# Altium project Gesturelink.PrjPcb (part 4 of 4)

## Sheet Audio.SchDoc
size 420 x 297 mm; SheetNumber: 9; SheetTotal: 16
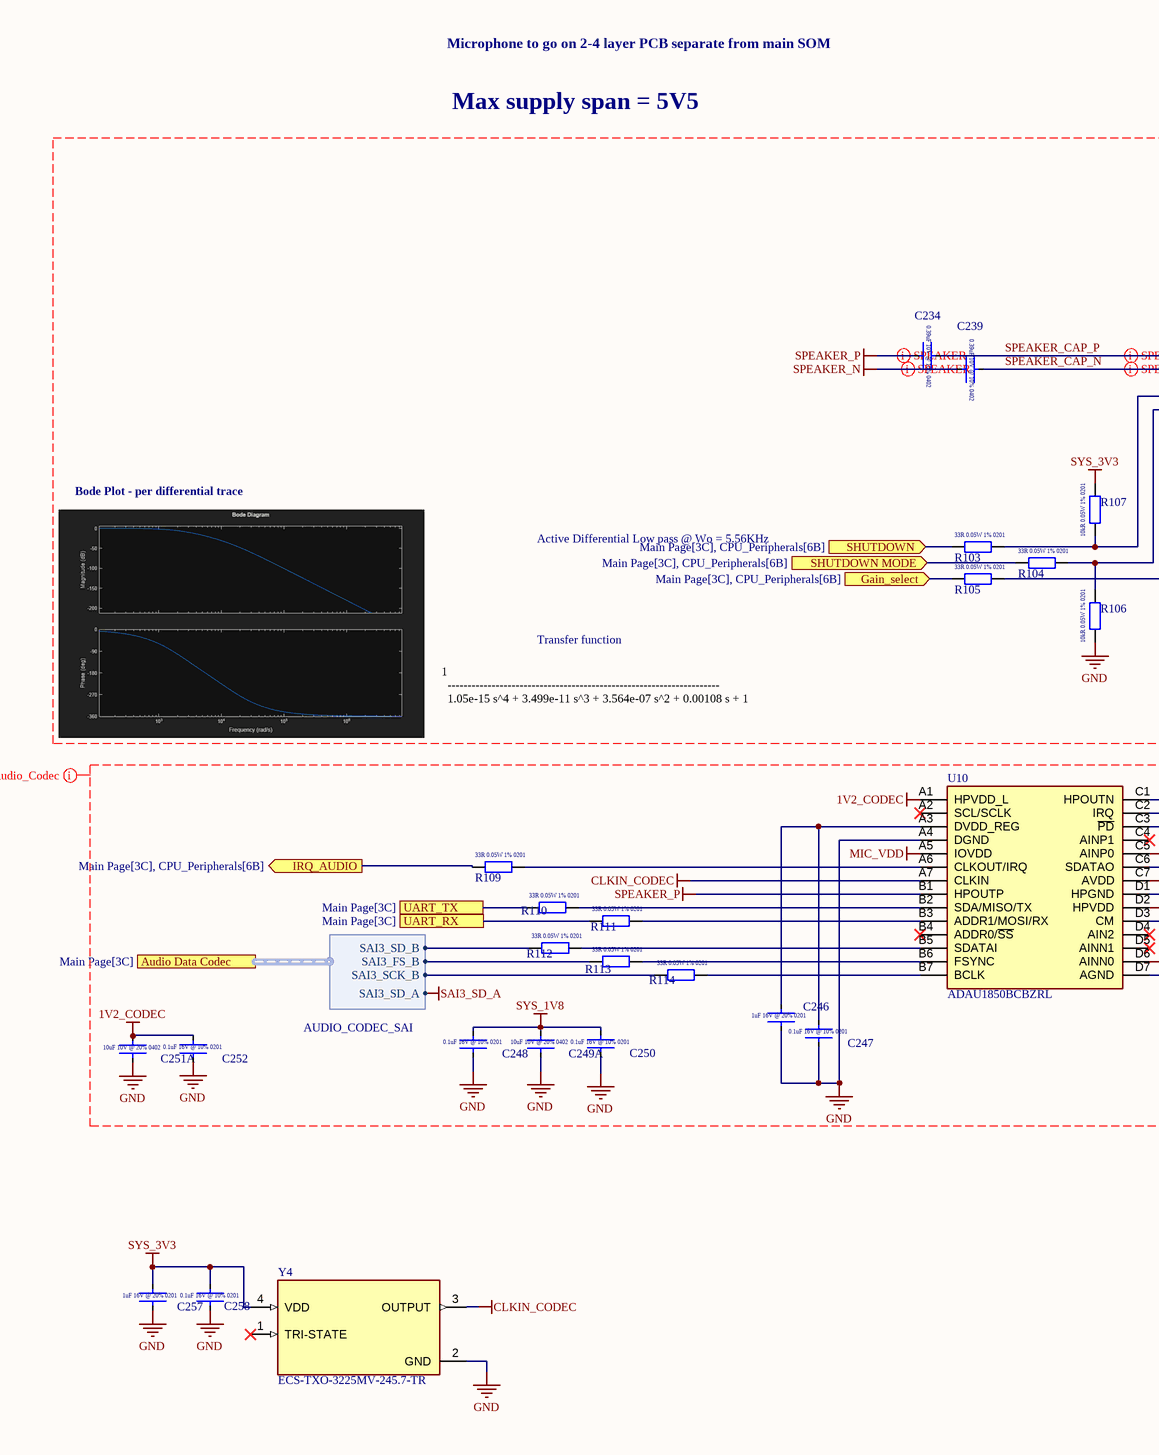
[diagram p19: Audio.SchDoc, left]
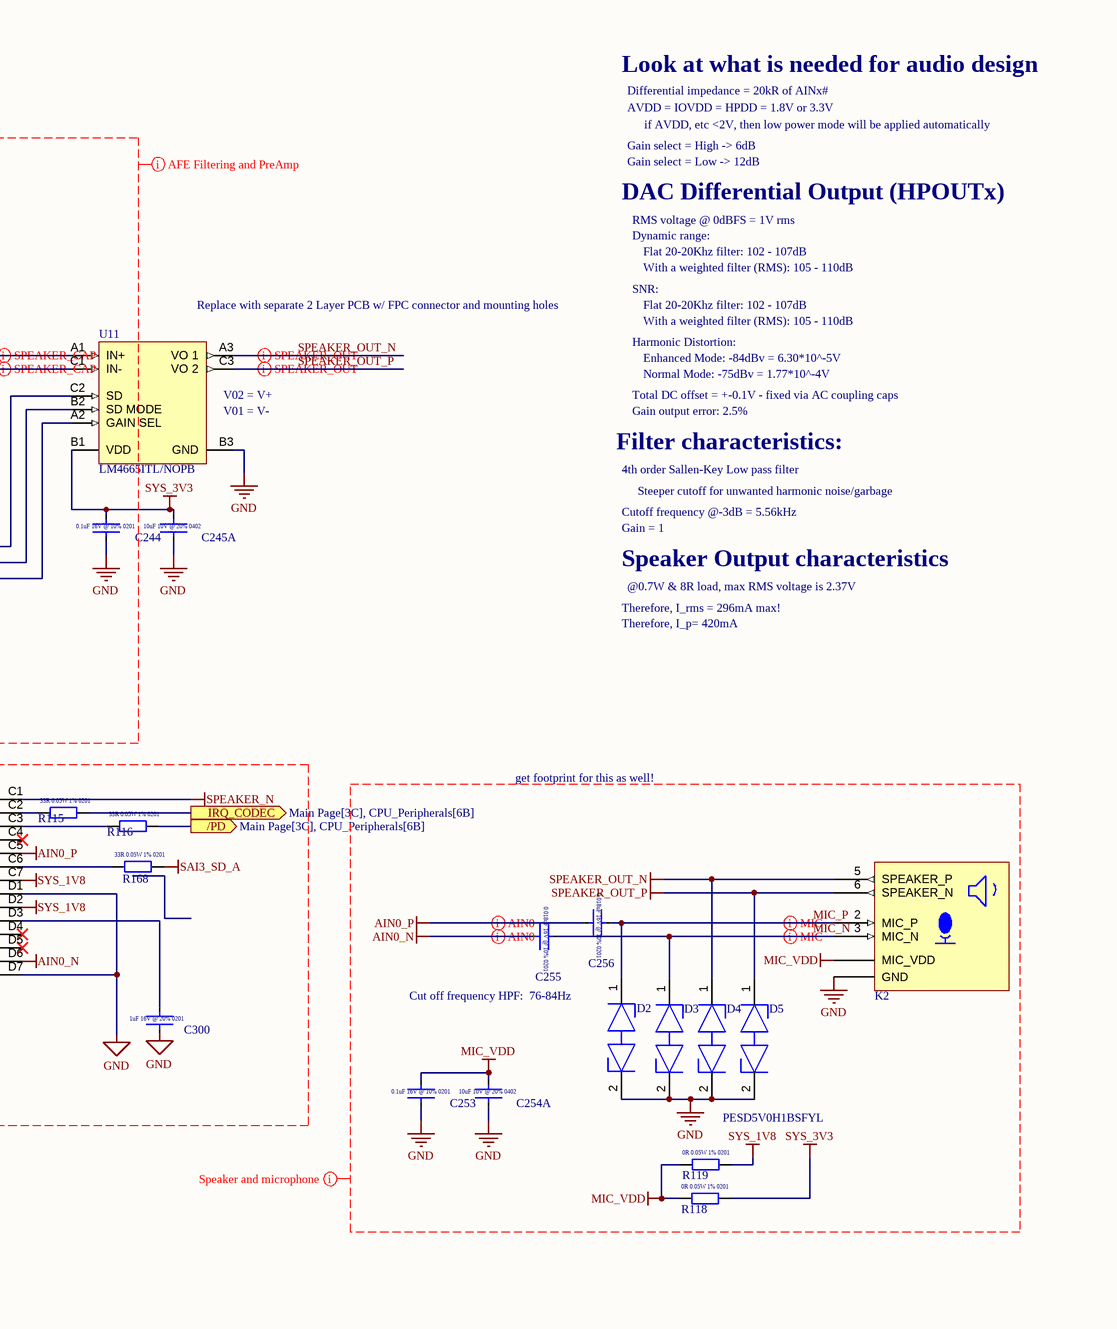
[diagram p20: Audio.SchDoc, right]

### Parts
C234  CC0402KRX5R6BB394  [CAPC1005X06L]  (value not drawn)
C239  CC0402KRX5R6BB394  [CAPC1005X06L]  (value not drawn)
C244  0.1uF  [CAPC0603X03L]  (value not drawn)
C245  GRT155R61A106ME13J  [CAPC1005X06L]  (value not drawn)  (part A of 2)
C246  GRM033R61C105ME15D  [CAPC0603X03L]  (value not drawn)
C247  0.1uF  [CAPC0603X03L]  (value not drawn)
C248  0.1uF  [CAPC0603X03L]  (value not drawn)
C249  GRT155R61A106ME13J  [CAPC1005X06L]  (value not drawn)  (part A of 2)
C250  0.1uF  [CAPC0603X03L]  (value not drawn)
C251  GRT155R61A106ME13J  [CAPC1005X06L]  (value not drawn)  (part A of 2)
C252  0.1uF  [CAPC0603X03L]  (value not drawn)
C253  0.1uF  [CAPC0603X03L]  (value not drawn)
C254  GRT155R61A106ME13J  [CAPC1005X06L]  (value not drawn)  (part A of 2)
C255  GRM033R61C183KE84D  [CAPC0603X03L]  (value not drawn)
C256  GRM033R61C183KE84D  [CAPC0603X03L]  (value not drawn)
C257  GRM033R61C105ME15D  [CAPC0603X03L]  (value not drawn)
C258  0.1uF  [CAPC0603X03L]  (value not drawn)
C300  GRM033R61C105ME15D  [CAPC0603X03L]  (value not drawn)
D2  PESD5V0H1BSFYL  [FP-SOD962-2-MFG]  (value not drawn)
D3  PESD5V0H1BSFYL  [FP-SOD962-2-MFG]  (value not drawn)
D4  PESD5V0H1BSFYL  [FP-SOD962-2-MFG]
D5  PESD5V0H1BSFYL  [FP-SOD962-2-MFG]  (value not drawn)
K2  DF40C-10DS-0.4V(51)  [DF40C-10DS-0.4V(51)]  (value not drawn)
R103  ERJ-1GNF33R0C  [RESC0603X03L]  (value not drawn)
R104  ERJ-1GNF33R0C  [RESC0603X03L]  (value not drawn)
R105  ERJ-1GNF33R0C  [RESC0603X03L]  (value not drawn)
R106  ERJ-1GNF1002C  [RESC0603X03L]  (value not drawn)
R107  ERJ-1GNF1002C  [RESC0603X03L]  (value not drawn)
R109  ERJ-1GNF33R0C  [RESC0603X03L]  (value not drawn)
R110  ERJ-1GNF33R0C  [RESC0603X03L]  (value not drawn)
R111  ERJ-1GNF33R0C  [RESC0603X03L]  (value not drawn)
R112  ERJ-1GNF33R0C  [RESC0603X03L]  (value not drawn)
R113  ERJ-1GNF33R0C  [RESC0603X03L]  (value not drawn)
R114  ERJ-1GNF33R0C  [RESC0603X03L]  (value not drawn)
R115  ERJ-1GNF33R0C  [RESC0603X03L]  (value not drawn)
R116  ERJ-1GNF33R0C  [RESC0603X03L]  (value not drawn)
R118  ERJ-1GN0R00C  [RESC0603X03L]  (value not drawn)
R119  ERJ-1GN0R00C  [RESC0603X03L]  (value not drawn)
R168  ERJ-1GNF33R0C  [RESC0603X03L]  (value not drawn)
U10  ADAU1850BCBZRL  [BGA28C40P7X4_296X176X57]
U11  LM4665ITL/NOPB  [YZR0009ADAD]
Y4  ECS-TXO-3225MV-245.7-TR  [OSC_ECS-TXO-3225MV-245.7-TR]

### Ports
/PD (out, see Main Page[3C], CPU_Peripherals[6B]), Audio Data Codec (harness AUDIO_CODEC_SAI, see Main Page[3C]), Gain_select (in, see Main Page[3C], CPU_Peripherals[6B]), IRQ_AUDIO (out, see Main Page[3C], CPU_Peripherals[6B]), IRQ_CODEC (out, see Main Page[3C], CPU_Peripherals[6B]), SHUTDOWN (in, see Main Page[3C], CPU_Peripherals[6B]), SHUTDOWN MODE (in, see Main Page[3C], CPU_Peripherals[6B]), UART_RX (see Main Page[3C]), UART_TX (see Main Page[3C])

### Harnesses
AUDIO_CODEC_SAI: SAI3_FS_B, SAI3_SCK_B, SAI3_SD_B, SAI3_SD_A

### Nets
1V2_CODEC: C251.2 C252.2 U10.A1(HPVDD_L)
AIN0_N: C255.1 U10.D6(AINN0)
AIN0_P: C256.1 U10.C5(AINP0)
CLKIN_CODEC: U10.A7(CLKIN) Y4.3(OUTPUT)
GND: C244.1 C245.1 C246.1 C247.1 C248.1 C249.1 C250.1 C251.1 C252.1 C253.1 C254.1 C257.1 C258.1 C300.1 D2.2(K2) D3.2(K2) D4.2(K2) D5.2(K2) K2.1,4,7,8,9,10,11,14(GND) R106.1 U10.A4(DGND) U10.D1(HPGND) U10.D7(AGND) U11.B3(GND) Y4.2(GND)
MIC_VDD: C253.2 C254.2 K2.12,13(MIC_VDD) R118.1 R119.1 U10.A5(IOVDD)
SAI3_FS_B: R113.1 ; port Audio Data Codec.SAI3_FS_B
SAI3_SCK_B: R114.1 ; port Audio Data Codec.SAI3_SCK_B
SAI3_SD_A: R168.2 ; port Audio Data Codec.SAI3_SD_A
SAI3_SD_B: R112.1 ; port Audio Data Codec.SAI3_SD_B
SPEAKER_N: C239.1 U10.C1(HPOUTN)
SPEAKER_OUT_N: D4.1(K1) K2.5(SPEAKER_P) U11.A3(VO_1)
SPEAKER_OUT_P: D5.1(K1) K2.6(SPEAKER_N) U11.C3(VO_2)
SPEAKER_P: C234.1 U10.B1(HPOUTP)
SYS_1V8: C248.2 C249.2 C250.2 R119.2 U10.C7(AVDD) U10.D2(HPVDD)
SYS_3V3: C244.2 C245.2 C257.2 C258.2 R107.2 R118.2 U11.B1(VDD) Y4.4(VDD)
/PD_CODEC: R116.2 ; port /PD
BKUP_IRQ_CODEC: R109.1 ; port IRQ_AUDIO
MAIN_IRQ_CODEC: R115.2 ; port IRQ_CODEC
MIC_N: C255.2 D3.1(K1) K2.3(MIC_N)
MIC_P: C256.2 D2.1(K1) K2.2(MIC_P)
PA_GAIN: R105.1 ; port Gain_select
PA_SHDN: R103.1 ; port SHUTDOWN
PA_SHDN_MODE: R104.1 ; port SHUTDOWN MODE
SPEAKER_CAP_N: C239.2 U11.C1(IN-)
SPEAKER_CAP_P: C234.2 U11.A1(IN+)
UART5_RX: R111.1 ; port UART_RX
UART5_TX: R110.1 ; port UART_TX
NetC246_2: C246.2 C247.2 U10.A3(DVDD_REG)
NetC300_2: C300.2 U10.D3(CM)
NetR103_2: R103.2 R107.1 U11.C2(SD)
NetR104_2: R104.2 R106.2 U11.B2(SD_MODE)
NetR105_2: R105.2 U11.A2(GAIN_SEL)
NetR109_2: R109.2 U10.A6(CLKOUT/IRQ)
NetR110_2: R110.2 U10.B2(SDA/MISO/TX)
NetR111_2: R111.2 U10.B3(ADDR1/MOSI/RX)
NetR112_2: R112.2 U10.B5(SDATAI)
NetR113_2: R113.2 U10.B6(FSYNC)
NetR114_2: R114.2 U10.B7(BCLK)
NetR115_1: R115.1 U10.C2(IRQ)
NetR116_1: R116.1 U10.C3(~{PD})
NetR168_1: R168.1 U10.C6(SDATAO)

Not connected (* = marked no-connect by the designer): U10 A2(SCL/SCLK)* B4(ADDR0/~{SS})* C4(AINP1)* D4(AIN2)* D5(AINN1)*; Y4 1(TRI-STATE)*

### Layout directives
mark named Audio FPC: (no net found under the mark)
differential pair: MIC_N, MIC_P, SPEAKER_CAP_N, SPEAKER_CAP_P, SPEAKER_N, SPEAKER_OUT_N, SPEAKER_OUT_P, SPEAKER_P
differential pair; net class *: AIN0_N, AIN0_P
net class Audio Codec: 1V2_CODEC, AIN0_N, AIN0_P, CLKIN_CODEC, GND, MIC_VDD, SAI3_SD_A, SPEAKER_N, SPEAKER_P, SYS_1V8
net class Speaker and microphone: AIN0_N, AIN0_P, GND, MIC_N, MIC_P, MIC_VDD, SPEAKER_OUT_N, SPEAKER_OUT_P, SYS_1V8, SYS_3V3
net class AFE Filtering and PreAmp: GND, SPEAKER_CAP_N, SPEAKER_CAP_P, SPEAKER_N, SPEAKER_P, SYS_3V3

### Notes on the sheet
- Microphone to go on 2-4 layer PCB separate from main SOM
- Look at what is needed for audio design
- Max supply span = 5V5
- Gain select = High -> 6dB
- Differential impedance = 20kR of AINx#
- AVDD = IOVDD = HPDD = 1.8V or 3.3V
- if AVDD, etc <2V, then low power mode will be applied automatically
- DAC Differential Output (HPOUTx)
- Gain select = Low -> 12dB
- RMS voltage @ 0dBFS = 1V rms
- Dynamic range:
- Flat 20-20Khz filter: 102 - 107dB
- With a weighted filter (RMS): 105 - 110dB
- (near U11) Replace with separate 2 Layer PCB w/ FPC connector and mounting holes
- SNR:
- Harmonic Distortion:
- (near U11) V02 = V+
- (near U11) V01 = V-
- Total DC offset = +-0.1V - fixed via AC coupling caps
- Gain output error: 2.5%
- Enhanced Mode: -84dBv = 6.30*10^-5V
- Normal Mode: -75dBv = 1.77*10^-4V
- Filter characteristics:
- 4th order Sallen-Key Low pass filter
- Bode Plot - per differential trace
- Active Differential Low pass @ Wo = 5.56KHz
- Cutoff frequency @-3dB = 5.56kHz
- Gain = 1
- Steeper cutoff for unwanted harmonic noise/garbage
- Speaker Output characteristics
- Therefore, I_rms = 296mA max!
- @0.7W & 8R load, max RMS voltage is 2.37V
- Transfer function
- Therefore, I_p= 420mA
- 1
  --------------------------------------------------------------------
  1.05e-15 s^4 + 3.499e-11 s^3 + 3.564e-07 s^2 + 0.00108 s + 1
- get footprint for this as well!
- (near D2) Cut off frequency HPF:  76-84Hz
- THIS DOCUMENT AND THE DATA DISCLOSED HEREIN OR
- HEREWITH IS THE PROPERTY OF ALTIUM LIMITED AND MAY
- DWG NO:
- REVISION
- REV:
- DESCRIPTION
- DATE
- APPROVED
- BE FREELY DISTRIBUTED IN WHOLE. NO RIGHTS ARE
- RESERVED OR EXPRESS OR IMPLIED WARANTEE GIVEN.
- ENG:
- APPROVALS
- PROJECT
- DSN:
- CHK:
- REFERENCE DOCUMENTS
- PROJECT REVISION:
- TITLE
- DOCUMENT REVISION:
- DESIGN ITEM:
- BOM:
- FAB DWG:
- PCB DWG:
- ASSY DWG:
- SCALE:
- A3
- SIZE
- CAGE CODE
- FILE NAME
- DWG NO.
- SHEET
- OF
- REV
- (in symbol CC0402KRX5R6BB394) 0.39uF 10V @ 10% 0402
- (in symbol ERJ-1GN0R00C) 0R 0.05W 1% 0201
- (in symbol ERJ-1GNF33R0C) 33R 0.05W 1% 0201
- (in symbol ERJ-1GNF1002C) 10kR 0.05W 1% 0201
- (in symbol GRM033R61C105ME15D) 1uF 16V @ 20% 0201
- (in symbol GRM033R61C183KE84D) 0.018uF 16V @ 10% 0201
- (in symbol GRM033R61E104KE14J) 0.1uF 16V @ 10% 0201
- (in symbol GRT155R61A106ME13J, part A) 10uF 10V @ 20% 0402

### Library data of the parts
C234 C239 = CC0402KRX5R6BB394: 0.39 µF ±10% 10V Ceramic Capacitor X5R 0402 (1005 Metric); ComponentLink1Description: New link; ComponentLink1URL: https://www.digikey.com.au/en/products/detail/yageo/CC0402KRX5R6BB394/20376267
C244 C247 C248 C250 C252 C253 C258 = GRM033R61E104KE14J: 0.1 µF ±10% 25V Ceramic Capacitor X5R 0201 (0603 Metric)0.1 µF ±10% 25V Ceramic Capacitor X5R 0201 (0603 Metric); ComponentLink1Description: New link; ComponentLink1URL: https://www.digikey.com.au/en/products/detail/murata-electronics/GRM033R61E104KE14J/4904732?s=N4IgTCBcDaIOICUCyAGAzGhA2AjAURxQBYBpAogKRAF0BfIA
C245 C249 C251 C254 = GRT155R61A106ME13J: 10 µF ±20% 10V Ceramic Capacitor X5R 0402 (1005 Metric); ComponentLink1Description: New link; ComponentLink1URL: https://www.digikey.com.au/en/products/detail/murata-electronics/GRT155R61A106ME13J/19115510
C246 C257 C300 = GRM033R61C105ME15D: 1 µF ±20% 16V Ceramic Capacitor X5R 0201 (0603 Metric); ComponentLink1Description: New link; ComponentLink1URL: https://www.digikey.com.au/en/products/detail/murata-electronics/GRM033R61C105ME15D/10326307
C255 C256 = GRM033R61C183KE84D: 0.018 µF ±10% 16V Ceramic Capacitor X5R 0201 (0603 Metric); ComponentLink1Description: New link; ComponentLink1URL: https://www.digikey.com.au/en/products/detail/murata-electronics/GRM033R61C183KE84D/5027499
D2-D5 = CMP-14436-000004-1: TVS DIODE 5V 5V DSN0603-2; Manufacturer: Nexperia; Breakdown Voltage: 6V; Direction: Bidirectional; Value: 0.15pF; Clamping Voltage: 6.3V; Number Of Channels: 1; Peak Pulse Current: 7A; Max Junction Temp: +150°C; Lead Free: Yes; Reverse Standoff Voltage: 5V; Footprint Url: https://assets.nexperia.com/documents/outline-drawing/SOD962-2.pdf; ComponentLink2Description: Datasheet; Height: 0.32mm; Ambient Temperature Range Low: -40°C; Manufacturer Part Number: PESD5V0H1BSFYL; Octopart: https://octopart.com/pesd5v0h1bsfyl-nexperia-78741149; Ambient Temperature Range High: +125°C; RoHS: TRUE; Temperature: to +150°C; Capacitance: 0.15pF; ComponentLink2URL: https://assets.nexperia.com/documents/data-sheet/PESD5V0H1BSF.pdf; Temperature Range High: +150°C; Device Class L2: TVS Diodes; Digikey Description: TVS DIODE 5V 5V DSN0603-2; Category: Diode; Device Class L3: unset; Device Class L1: Circuit Protection; Package: SOD962-2; Automotive: No
K2 = DF40C-10DS-0.4V(51): 10 Position Connector Plug, Outer Shroud Contacts Surface Mount Gold; ComponentLink1Description: New link; ComponentLink1URL: https://www.digikey.com.au/en/products/detail/hirose-electric-co-ltd/DF40C-10DP-0-4V-51/1969496; Supplier 1: Digikey; Supplier Part Number 1: H11616CT-ND
R103-R105 R109-R116 R168 = ERJ-1GNF33R0C: as R73-R80 on sheet WIFI and BLE; ComponentLink1Description: New link; ComponentLink1URL: https://www.digikey.com.au/en/products/detail/panasonic-electronic-components/ERJ-1GNF33R0C/2035941
R106 R107 = ERJ-1GNF1002C: as R66-R68 on sheet WIFI and BLE; ComponentLink1Description: New link; ComponentLink1URL: https://www.digikey.com.au/en/products/detail/panasonic-electronic-components/ERJ-1GNF1002C/2036226
R118 R119 = ERJ-1GN0R00C: 0 Ohms Jumper Chip Resistor 0201 (0603 Metric) Thick Film; ComponentLink1Description: New link; ComponentLink1URL: https://www.digikey.com.au/en/products/detail/panasonic-electronic-components/ERJ-1GN0R00C/3982613
U10 = ADAU1850BCBZRL: Integrated Circuit; Manufacturer_Name: Analog Devices; Datasheet Link: https://www.analog.com/ADAU1850/datasheet?ADICID=SYND_WW_P682800_PF-spglobal; Height: 0.57mm; Manufacturer_Part_Number: ADAU1850BCBZRL
U11 = CMP-0057-00216-3: Filterless High Efficiency 1W Switching Audio Amplifier, 9-pin Micro SMD, Pb-Free; Manufacturer: Texas Instruments; CompType: Audio IC; PowerWise: N; High-Reliability: Y; PackageTopMarking: XVG*I A2; RoHS: Y; PackageReference: YZR0009ADAD; PartNumber: LM4665ITL/NOPB; PinCount: 9; Code_JEDEC: MO-211-DD; ComponentLink1URL: http://www.ti.com/general/docs/lit/getliterature.tsp?genericPartNumber=LM4665&fileType=pdf; PackageDescription: Thin Micro SMD, 9 Bump (Large), 0.5mm Pitch; ComponentLink1Description: Datasheet URL; ComponentLink2Description: New link; ComponentLink2URL: https://www.digikey.com.au/en/products/detail/texas-instruments/LM4665ITL-NOPB/947582?srsltid=AfmBOooQQxw4q3qhtfItGu5hSrTxqZeWwiOQWCJ-ImR-j4MOWvtk_TuD
Y4 = ECS-TXO-3225MV-245.7-TR: TCXO Oscillators 24.576 MHZ Multi-Volt +1.7 3.6V HCMOS TCXO +/-2.5 ppm -30 +85 C 3.2x 2.5mm RoHS; MF: ECS; SnapEDA_Link: https://www.snapeda.com/parts/ECS-TXO-3225MV-245.7-TR/ECS/view-part/?ref=snap; Package: ECS-TXO-3225MV-0-4 ECS; Value: *; MP: ECS-TXO-3225MV-245.7-TR; Check_prices: https://www.snapeda.com/parts/ECS-TXO-3225MV-245.7-TR/ECS/view-part/?ref=eda; ComponentLink1Description: New link; ComponentLink1URL: https://www.digikey.com.au/en/products/detail/ecs-inc/ECS-TXO-3225MV-245-7-TR/16578392?s=N4IgjCBcpgHAzFUBjKAzAhgGwM4FMAaEAeygG0QAWMABgDYAmOkAXSIAcAXKEAZU4BOASwB2AcxABfIgwDszaCFSRMuQiXIg6YeDRqsO3SH0GiJ08AE5YlpEvTZ8RUpAr6WFhmACs%2BxctUnDVcQBkoAOm95AAIAWQAJAC8DEC4eAFURIU4AeTRYvAwcAFcBPClJSSA

## Sheet External Power Connectors.SchDoc
size A4; SheetNumber: 16; SheetTotal: 16
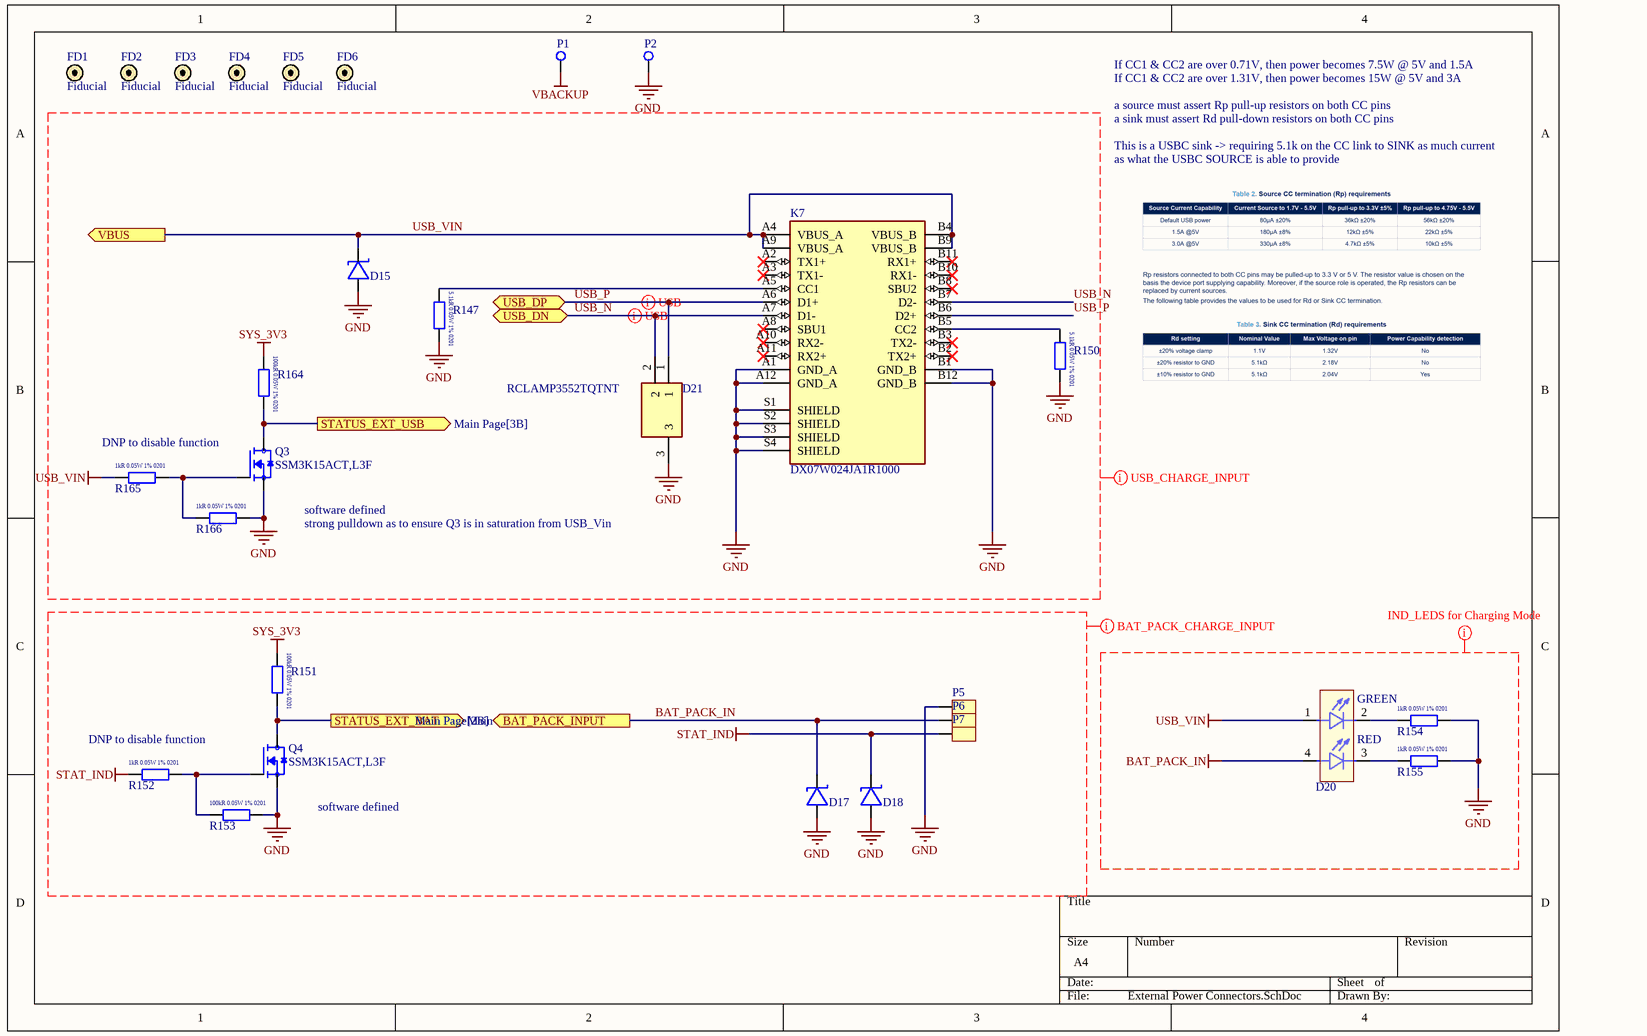
[diagram p21: External Power Connectors.SchDoc]

### Parts
D15  RCLAMP04041PW.C  [RCLAMP04041PW.C]  (value not drawn)
D17  RCLAMP04041PW.C  [RCLAMP04041PW.C]  (value not drawn)
D18  RCLAMP04041PW.C  [RCLAMP04041PW.C]  (value not drawn)
D20  APGB0607G22R23C  [LED_APGB0607G22R23C]  (value not drawn)
D21  RCLAMP3552TQTNT  [RCLAMP3552TQTNT]
FD1  Fiducial  [Fiducial]
FD2  Fiducial  [Fiducial]
FD3  Fiducial  [Fiducial]
FD4  Fiducial  [Fiducial]
FD5  Fiducial  [Fiducial]
FD6  Fiducial  [Fiducial]
K7  DX07W024JA1R1000  [JAE_DX07W024JA1R1000]
P1  Pogo pin Pad  [S70-220101045R]  (value not drawn)
P2  Pogo pin Pad  [S70-220101045R]  (value not drawn)
P5  Pad for Bat  [Pad for Bat]  (value not drawn)
P6  Pad for Bat  [Pad for Bat]  (value not drawn)
P7  Pad for Bat  [Pad for Bat]  (value not drawn)
Q3  SSM3K15ACT,L3F  [SSM3K15ACT]
Q4  SSM3K15ACT,L3F  [SSM3K15ACT]
R147  ERJ-1GNF5101C  [RESC0603X03L]  (value not drawn)
R150  ERJ-1GNF5101C  [RESC0603X03L]  (value not drawn)
R151  ERJ-1GNF1003C  [RESC0603X03L]  (value not drawn)
R152  ERJ-1GNF1001C  [RESC0603X03L]  (value not drawn)
R153  ERJ-1GNF1003C  [RESC0603X03L]  (value not drawn)
R154  ERJ-1GNF1001C  [RESC0603X03L]  (value not drawn)
R155  ERJ-1GNF1001C  [RESC0603X03L]  (value not drawn)
R164  ERJ-1GNF1003C  [RESC0603X03L]  (value not drawn)
R165  ERJ-1GNF1001C  [RESC0603X03L]  (value not drawn)
R166  ERJ-1GNF1001C  [RESC0603X03L]  (value not drawn)

### Ports
BAT_PACK_INPUT (out, see Main Page[2B]), STATUS_EXT_BAT (out, see Main Page[3B]), STATUS_EXT_USB (out, see Main Page[3B]), USB_DN (bidir, see Main Page[3B]), USB_DP (bidir, see Main Page[3B]), VBUS (out, see Main Page[2B])

### Nets
BAT_PACK_IN: D17.2 D20.4(A_RED) P6.1 ; port BAT_PACK_INPUT
GND: D15.1 D17.1 D18.1 D21.3 K7.A1(GND_A) K7.A12(GND_A) K7.B1(GND_B) K7.B12(GND_B) K7.S1(SHIELD) K7.S2(SHIELD) K7.S3(SHIELD) K7.S4(SHIELD) P2.1 P5.1 Q3.3(S) Q4.3(S) R147.2 R150.2 R153.2 R154.2 R155.2 R166.2
STAT_IND: D18.2 P7.1 R152.1
SYS_3V3: R151.1 R164.1
USB_VIN: D15.2 D20.1(A_GREEN) K7.A4(VBUS_A) K7.A9(VBUS_A) K7.B4(VBUS_B) K7.B9(VBUS_B) R165.1 ; port VBUS
VBACKUP: P1.1
STATUS_EXT_BAT_MPU: Q4.2(D) R151.2 ; port STATUS_EXT_BAT
STATUS_EXT_USB_MPU: Q3.2(D) R164.2 ; port STATUS_EXT_USB
USB_N: D21.2 K7.A7(D1-) K7.B7(D2-) ; port USB_DN
USB_P: D21.1 K7.A6(D1+) K7.B6(D2+) ; port USB_DP
NetD20_2: D20.2(C_GREEN) R154.1
NetD20_3: D20.3(C_RED) R155.1
NetK7_A5: K7.A5(CC1) R147.1
NetK7_B5: K7.B5(CC2) R150.1
NetQ3_1: Q3.1(G) R165.2 R166.1
NetQ4_1: Q4.1(G) R152.2 R153.1

Not connected (* = marked no-connect by the designer): K7 A2(TX1+)* A3(TX1-)* A8(SBU1)* A10(RX2-)* A11(RX2+)* B2(TX2+)* B3(TX2-)* B8(SBU2)* B10(RX1-)* B11(RX1+)*

### Layout directives
differential pair: USB_N, USB_P
net class USB_CHARGE_INPUT: GND, SYS_3V3, USB_N, USB_P, USB_VIN
net class BAT_PACK_CHARGE_INPUT: BAT_PACK_IN, GND, STAT_IND, SYS_3V3
net class IND_LEDS for Charging Mode: BAT_PACK_IN, GND, USB_VIN

### Notes on the sheet
- If CC1 & CC2 are over 0.71V, then power becomes 7.5W @ 5V and 1.5A
- If CC1 & CC2 are over 1.31V, then power becomes 15W @ 5V and 3A
- a source must assert Rp pull-up resistors on both CC pins
- a sink must assert Rd pull-down resistors on both CC pins
- This is a USBC sink -> requiring 5.1k on the CC link to SINK as much current
- as what the USBC SOURCE is able to provide
- (near Q3) DNP to disable function
- software defined
- strong pulldown as to ensure Q3 is in saturation from USB_Vin
- DNP to disable function
- (in symbol APGB0607G22R23C) GREEN; RED
- (in symbol ERJ-1GNF1001C) 1kR 0.05W 1% 0201
- (in symbol ERJ-1GNF1003C) 100kR 0.05W 1% 0201
- (in symbol ERJ-1GNF5101C) 5.1kR 0.05W 1% 0201

### Library data of the parts
D15 D17 D18 = RCLAMP04041PW.C: 8V Clamp 20A (8/20µs) Ipp Tvs Diode Surface Mount 2-DFN (1x0.6); ComponentLink1Description: New link; ComponentLink1URL: https://www.digikey.com.au/en/products/detail/semtech-corporation/RCLAMP04041PW-C/21379403
D20 = APGB0607G22R23C: Green, Red 525nm Green, 624nm Red LED Indication - Discrete 2.85V Green, 1.95V Red 4-SMD, No Lead; ComponentLink1Description: New link; ComponentLink1URL: https://www.digikey.com/en/products/detail/kingbright/APGB0607G22R23C/22561020
D21 = RCLAMP3552TQTNT: TVS Diode (Bi-directional); Manufacturer_Name: SEMTECH; Datasheet Link: https://semtech.my.salesforce.com/sfc/p/#E0000000JelG/a/2R000000UohO/V4d3xrkq_aAf9cXb8fvHnUsEIcun.v6swlyE.QX6HEE; Height: 0.43mm; Manufacturer_Part_Number: RCLAMP3552TQTNT; Mouser Part Number: 947-RCLAMP3552TQTNT; Mouser Price/Stock: https://www.mouser.co.uk/ProductDetail/Semtech/RCLAMP3552TQTNT?qs=gTYE2QTfZfQzabe3OC25DQ%3D%3D; Arrow Part Number: RCLAMP3552TQTNT; Arrow Price/Stock: https://www.arrow.com/en/products/rclamp3552tqtnt/semtech?utm_currency=USD&region=nac
K7 = DX07W024JA1R1000: USB-C (USB TYPE-C) USB 3.2 Gen 2 (USB 3.1 Gen 2, Superspeed + (USB 3.1)) Receptacle Connector 24 Position Board Edge, Surface Mount, Right Angle; MF: JAE Electronics; SnapEDA_Link: https://www.snapeda.com/parts/DX07W024JA1R1000/JAE+Electronics/view-part/?ref=snap; Package: None; Value: *; MP: DX07W024JA1R1000; Check_prices: https://www.snapeda.com/parts/DX07W024JA1R1000/JAE+Electronics/view-part/?ref=eda; ComponentLink1Description: New link; ComponentLink1URL: https://www.digikey.com.au/en/products/detail/jae-electronics/DX07W024JA1R1000/9646471
P1 P2 = Pogo pin Pad: Contact Spring Surface Mount
Q3 Q4 = SSM3K15ACT,L3F: N-Channel 30 V 100mA (Ta) 100mW (Ta) Surface Mount CST3; ComponentLink1Description: New link; ComponentLink1URL: https://www.digikey.com.au/en/products/detail/toshiba-semiconductor-and-storage/SSM3K15ACT-L3F/5298026
R147 R150 = ERJ-1GNF5101C: 5.1 kOhms ±1% 0.05W, 1/20W Chip Resistor 0201 (0603 Metric) Thick Film; ComponentLink1Description: New link; ComponentLink1URL: https://www.digikey.com.au/en/products/detail/panasonic-electronic-components/ERJ-1GNF5101C/2036192
R151 R153 R164 = ERJ-1GNF1003C: 100 kOhms ±1% 0.05W, 1/20W Chip Resistor 0201 (0603 Metric) Thick Film; ComponentLink1Description: New link; ComponentLink1URL: https://www.digikey.com.au/en/products/detail/panasonic-electronic-components/ERJ-1GNF1003C/2036340
R152 R154 R155 R165 R166 = ERJ-1GNF1001C: 1 kOhms ±1% 0.05W, 1/20W Chip Resistor 0201 (0603 Metric) Thick Film

## Sheet IMU Gesture Recognition Sensors.SchDoc
size A4; SheetNumber: 11; SheetTotal: 17
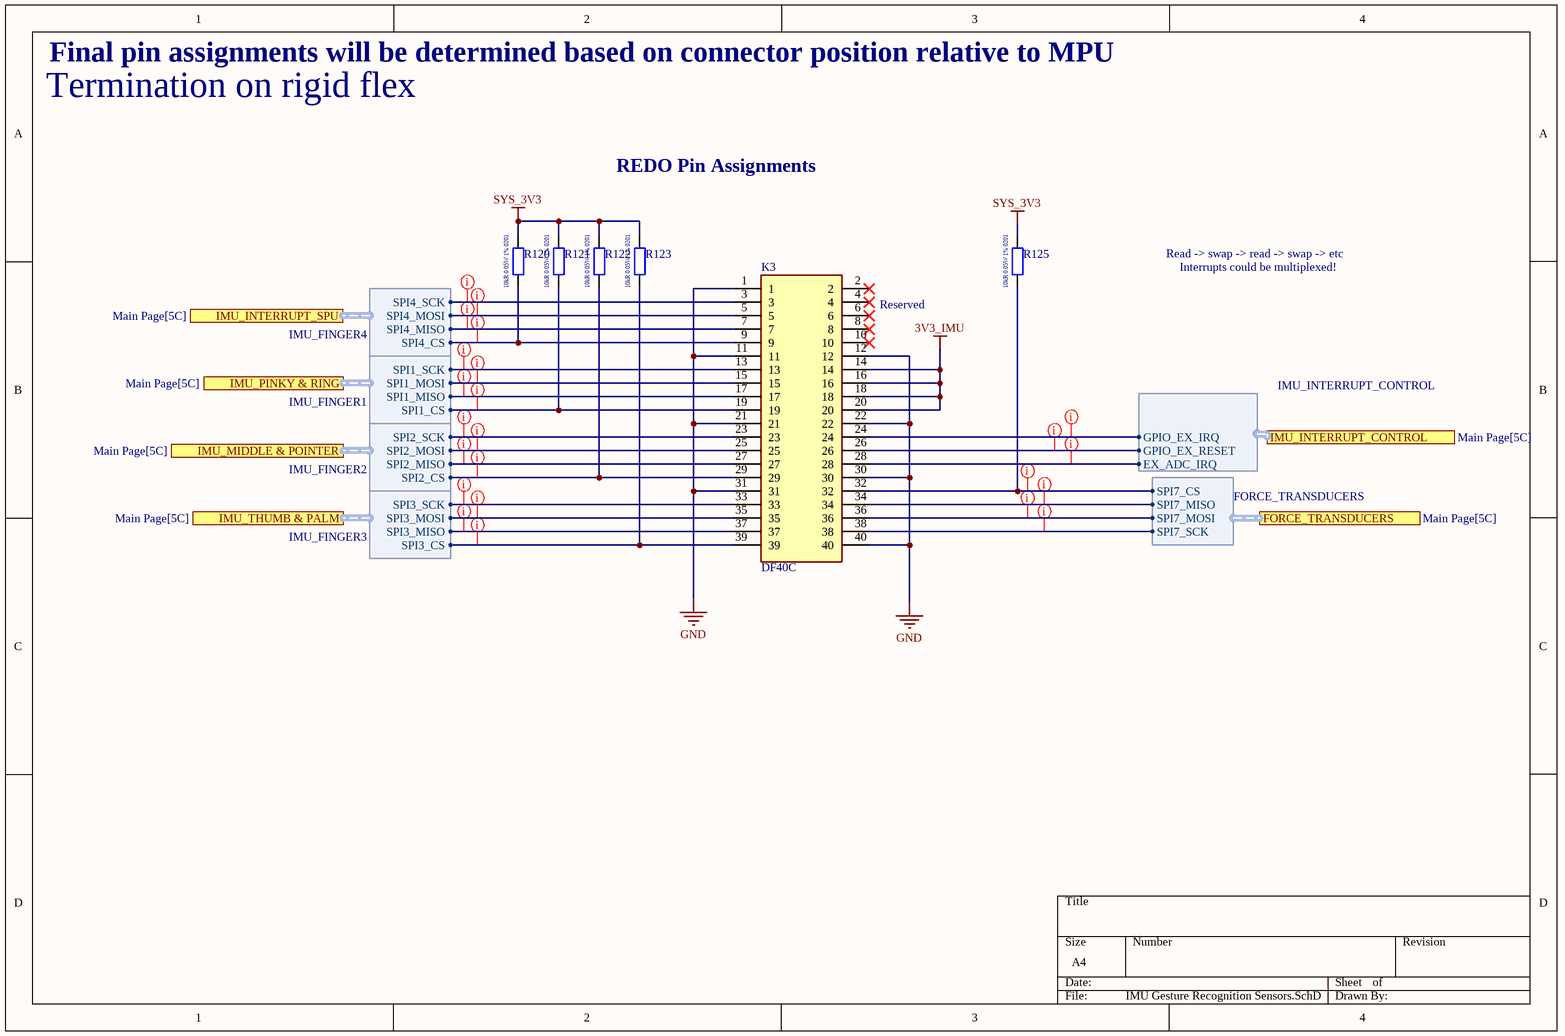
[diagram p22: IMU Gesture Recognition Sensors.SchDoc]

### Parts
K3  DF40C  [HIROSE_DF40C-40DS-0.4V(51)]
R120  ERJ-1GNF1002C  [RESC0603X03L]  (value not drawn)
R121  ERJ-1GNF1002C  [RESC0603X03L]  (value not drawn)
R122  ERJ-1GNF1002C  [RESC0603X03L]  (value not drawn)
R123  ERJ-1GNF1002C  [RESC0603X03L]  (value not drawn)
R125  ERJ-1GNF1002C  [RESC0603X03L]  (value not drawn)

### Ports
FORCE_TRANSDUCERS (harness FORCE_TRANSDUCERS, see Main Page[5C]), IMU_INTERRUPT_CONTROL (harness IMU_INTERRUPT_CONTROL, see Main Page[5C]), IMU_INTERRUPT_SPU (harness IMU_FINGER4, see Main Page[5C]), IMU_MIDDLE & POINTER (harness IMU_FINGER2, see Main Page[5C]), IMU_PINKY & RING (harness IMU_FINGER1, see Main Page[5C]), IMU_THUMB & PALM (harness IMU_FINGER3, see Main Page[5C])

### Harnesses
IMU_FINGER1: SPI1_CS, SPI1_MISO, SPI1_MOSI, SPI1_SCK
IMU_FINGER2: SPI2_CS, SPI2_MISO, SPI2_MOSI, SPI2_SCK
IMU_FINGER3: SPI3_CS, SPI3_MISO, SPI3_MOSI, SPI3_SCK
IMU_FINGER4: SPI4_CS, SPI4_MISO, SPI4_MOSI, SPI4_SCK
FORCE_TRANSDUCERS: SPI7_CS, SPI7_MISO, SPI7_MOSI, SPI7_SCK
IMU_INTERRUPT_CONTROL: GPIO_EX_IRQ, GPIO_EX_RESET, EX_ADC_IRQ

### Nets
3V3_IMU: K3.14 K3.16 K3.18 K3.20
GND: K3.1 K3.11 K3.12 K3.21 K3.22 K3.30 K3.31 K3.40
SPI1_CS: K3.19 R121.1 ; port IMU_PINKY & RING.SPI1_CS
SPI1_MISO: K3.17 ; port IMU_PINKY & RING.SPI1_MISO
SPI1_MOSI: K3.15 ; port IMU_PINKY & RING.SPI1_MOSI
SPI1_SCK: K3.13 ; port IMU_PINKY & RING.SPI1_SCK
SPI2_CS: K3.29 R122.1 ; port IMU_MIDDLE & POINTER.SPI2_CS
SPI2_MISO: K3.27 ; port IMU_MIDDLE & POINTER.SPI2_MISO
SPI2_MOSI: K3.25 ; port IMU_MIDDLE & POINTER.SPI2_MOSI
SPI2_SCK: K3.23 ; port IMU_MIDDLE & POINTER.SPI2_SCK
SPI3_CS: K3.39 R123.1 ; port IMU_THUMB & PALM.SPI3_CS
SPI3_MISO: K3.37 ; port IMU_THUMB & PALM.SPI3_MISO
SPI3_MOSI: K3.35 ; port IMU_THUMB & PALM.SPI3_MOSI
SPI3_SCK: K3.33 ; port IMU_THUMB & PALM.SPI3_SCK
SPI4_CS: K3.9 R120.1 ; port IMU_INTERRUPT_SPU.SPI4_CS
SPI4_MISO: K3.7 ; port IMU_INTERRUPT_SPU.SPI4_MISO
SPI4_MOSI: K3.5 ; port IMU_INTERRUPT_SPU.SPI4_MOSI
SPI4_SCK: K3.3 ; port IMU_INTERRUPT_SPU.SPI4_SCK
SPI7_CS: K3.32 R125.1 ; port FORCE_TRANSDUCERS.SPI7_CS
SPI7_MISO: K3.34 ; port FORCE_TRANSDUCERS.SPI7_MISO
SPI7_MOSI: K3.36 ; port FORCE_TRANSDUCERS.SPI7_MOSI
SPI7_SCK: K3.38 ; port FORCE_TRANSDUCERS.SPI7_SCK
SYS_3V3: R120.2 R121.2 R122.2 R123.2 R125.2
EXT_ADC_IRQ: K3.28 ; port IMU_INTERRUPT_CONTROL.EX_ADC_IRQ
GPIO_EXTENDER_IRQ: K3.24 ; port IMU_INTERRUPT_CONTROL.GPIO_EX_IRQ
GPIO_EXTENDER_RESET: K3.26 ; port IMU_INTERRUPT_CONTROL.GPIO_EX_RESET

Not connected (* = marked no-connect by the designer): K3 2* 4* 6* 8* 10*

### Layout directives
net class SPI_IMU: SPI1_CS, SPI1_MISO, SPI1_MOSI, SPI1_SCK, SPI2_CS, SPI2_MISO, SPI2_MOSI, SPI2_SCK, SPI3_CS, SPI3_MISO, SPI3_MOSI, SPI3_SCK, SPI4_CS, SPI4_MISO, SPI4_MOSI, SPI4_SCK, SPI7_CS, SPI7_MISO, SPI7_MOSI, SPI7_SCK
net class IMU_INTERRUPTS: EXT_ADC_IRQ, GPIO_EXTENDER_IRQ, GPIO_EXTENDER_RESET

### Notes on the sheet
- Termination on rigid flex
- Final pin assignments will be determined based on connector position relative to MPU
- REDO Pin Assignments
- (near K3) Reserved
- Read -> swap -> read -> swap -> etc
- Interrupts could be multiplexed!
- (near K3) SPI4
- (near K3) SPI1
- (near K3) SPI2
- (near K3) SPI3
- (in symbol ERJ-1GNF1002C) 10kR 0.05W 1% 0201

### Library data of the parts
K3 = DF40C: 40 Position Connector Receptacle, Center Strip Contacts Surface Mount Gold; Supplier 1: Avnet; Supplier Part Number 1: DF40C-40DS-0.4V(51)
R120-R123 R125 = ERJ-1GNF1002C: as R66-R68 on sheet WIFI and BLE; ComponentLink1Description: New link; ComponentLink1URL: https://www.digikey.com.au/en/products/detail/panasonic-electronic-components/ERJ-1GNF1002C/2036226

## Sheet Transport Layer Security.SchDoc
size A4; SheetNumber: 14; SheetTotal: 18
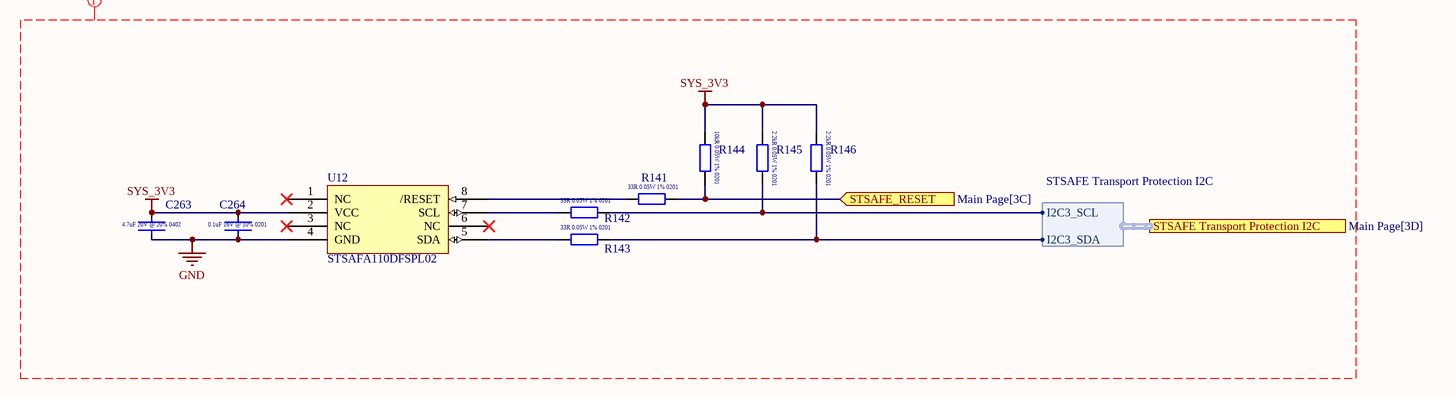
[diagram p23: Transport Layer Security.SchDoc]

### Parts
C263  4.7uF  [CAPC1005X06L]  (value not drawn)
C264  0.1uF  [CAPC0603X03L]  (value not drawn)
R141  ERJ-1GNF33R0C  [RESC0603X03L]  (value not drawn)
R142  ERJ-1GNF33R0C  [RESC0603X03L]  (value not drawn)
R143  ERJ-1GNF33R0C  [RESC0603X03L]  (value not drawn)
R144  ERJ-1GNF1002C  [RESC0603X03L]  (value not drawn)
R145  RC0201FR-072K2L  [RESC0603X03L]  (value not drawn)
R146  RC0201FR-072K2L  [RESC0603X03L]  (value not drawn)
U12  STSAFA110DFSPL02  [STSAFE-A110]

### Ports
STSAFE Transport Protection I2C (harness STSAFE Transport Protection I2C, see Main Page[3D]), STSAFE_RESET (in, see Main Page[3C])

### Harnesses
STSAFE Transport Protection I2C: I2C3_SCL, I2C3_SDA

### Nets
GND: C263.1 C264.1 U12.4(GND)
I2C5_SCL: R142.2 R145.2 ; port STSAFE Transport Protection I2C.I2C3_SCL
I2C5_SDA: R143.2 R146.2 ; port STSAFE Transport Protection I2C.I2C3_SDA
SYS_3V3: C263.2 C264.2 R144.1 R145.1 R146.1 U12.2(VCC)
STSAFE_RESET: R141.2 R144.2 ; port STSAFE_RESET
NetR141_1: R141.1 U12.8(/RESET)
NetR142_1: R142.1 U12.7(SCL)
NetR143_1: R143.1 U12.5(SDA)

Not connected (* = marked no-connect by the designer): U12 1(NC)* 3(NC)* 6(NC)*

### Layout directives
net class STSAFE: GND, SYS_3V3

### Notes on the sheet
- (in symbol CL05A475MO5NUNC) 4.7uF 20V @ 20% 0402
- (in symbol ERJ-1GNF33R0C) 33R 0.05W 1% 0201
- (in symbol ERJ-1GNF1002C) 10kR 0.05W 1% 0201
- (in symbol GRM033R61E104KE14J) 0.1uF 16V @ 10% 0201
- (in symbol RC0201FR-072K2L) 2.2kR 0.05W 1% 0201

### Library data of the parts
C263 = CL05A475MO5NUNC: 4.7 µF ±20% 16V Ceramic Capacitor X5R 0402 (1005 Metric)
C264 = GRM033R61E104KE14J: as C244 on sheet Audio; ComponentLink1Description: New link; ComponentLink1URL: https://www.digikey.com.au/en/products/detail/murata-electronics/GRM033R61E104KE14J/4904732?s=N4IgTCBcDaIOICUCyAGAzGhA2AjAURxQBYBpAogKRAF0BfIA
R141-R143 = ERJ-1GNF33R0C: as R73-R80 on sheet WIFI and BLE; ComponentLink1Description: New link; ComponentLink1URL: https://www.digikey.com.au/en/products/detail/panasonic-electronic-components/ERJ-1GNF33R0C/2035941
R144 = ERJ-1GNF1002C: as R66-R68 on sheet WIFI and BLE; ComponentLink1Description: New link; ComponentLink1URL: https://www.digikey.com.au/en/products/detail/panasonic-electronic-components/ERJ-1GNF1002C/2036226
R145 R146 = RC0201FR-072K2L: 2.2 kOhms ±1% 0.05W, 1/20W Chip Resistor 0201 (0603 Metric) Moisture Resistant Thick Film
U12 = STSAFA110DFSPL02: Authentication Chip, IoT Secure Element 8-UFDFPN (2x3); ComponentLink1Description: New link; ComponentLink1URL: https://www.digikey.com.au/en/products/detail/stmicroelectronics/STSAFA110DFSPL02/13180776

## Sheet Connector A.SchDoc
size A4; SheetNumber: 12; SheetTotal: 16
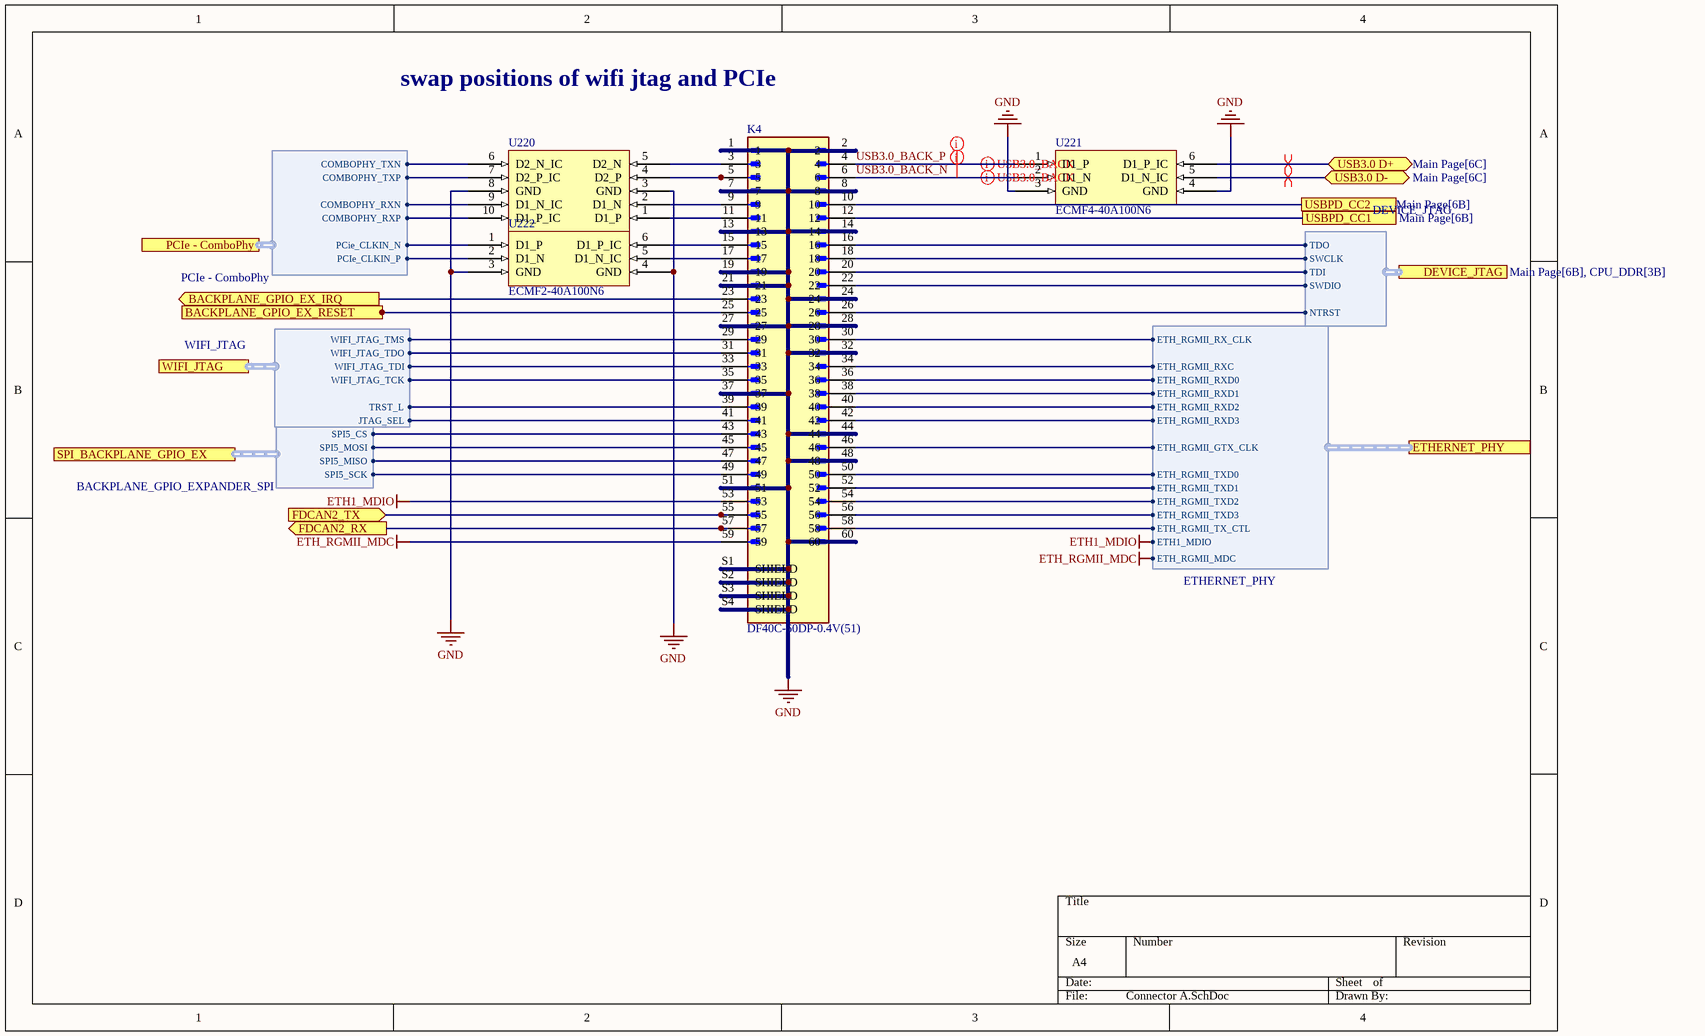
[diagram p24: Connector A.SchDoc]

### Parts
K4  DF40C-60DP-0.4V(51)  [HIROSE_DF40C-60DP-0.4V(51)]
U220  ECMF4-40A100N10  [ECMF4-40A100N10]  (value not drawn)
U221  ECMF4-40A100N6  [ECMF2-40A100N6]
U222  ECMF2-40A100N6  [ECMF2-40A100N6]

### Ports
BACKPLANE_GPIO_EX_IRQ (out, see Main Page[6C]), BACKPLANE_GPIO_EX_RESET (in, see Main Page[6C]), DEVICE_JTAG (harness DEVICE_JTAG, see Main Page[6B], CPU_DDR[3B]), ETHERNET_PHY (harness ETHERNET_PHY, see Main Page[6B]), FDCAN2_RX (out, see Main Page[6C], CPU_Peripherals[4E]), FDCAN2_TX (in, see Main Page[6B], CPU_Peripherals[4E]), PCIe - ComboPhy (harness PCIe - ComboPhy, see Main Page[6B]), SPI_BACKPLANE_GPIO_EX (harness BACKPLANE_GPIO_EXPANDER_SPI, see Main Page[6B], CPU_Peripherals[0B]), USB3.0 D+ (bidir, see Main Page[6C]), USB3.0 D- (bidir, see Main Page[6C]), USBPD_CC1 (see Main Page[6B]), USBPD_CC2 (see Main Page[6B]), WIFI_JTAG (harness WIFI_JTAG, see Main Page[6C], WIFI and BLE[6B])

### Harnesses
DEVICE_JTAG: NTRST, SWCLK, SWDIO, TDI, TDO
WIFI_JTAG: JTAG_SEL, TRST_L, WIFI_JTAG_TCK, WIFI_JTAG_TDI, WIFI_JTAG_TDO, WIFI_JTAG_TMS
PCIe - ComboPhy: COMBOPHY_RXN, COMBOPHY_RXP, COMBOPHY_TXN, COMBOPHY_TXP, PCie_CLKIN_N, PCIe_CLKIN_P
ETHERNET_PHY: ETH_RGMII_GTX_CLK, ETH_RGMII_RXC, ETH_RGMII_RXD0, ETH_RGMII_RXD1, ETH_RGMII_RXD2, ETH_RGMII_RXD3, ETH_RGMII_RX_CLK, ETH_RGMII_TXD0, ETH_RGMII_TXD1, ETH_RGMII_TXD2, ETH_RGMII_TXD3, ETH_RGMII_TX_CTL, ETH1_MDIO, ETH_RGMII_MDC
BACKPLANE_GPIO_EXPANDER_SPI: SPI5_SCK, SPI5_MOSI, SPI5_MISO, SPI5_CS

### Nets
ETH1_MDIO: K4.53 ; port ETHERNET_PHY.ETH1_MDIO
ETH_RGMII_GTX_CLK: K4.46 ; port ETHERNET_PHY.ETH_RGMII_GTX_CLK
ETH_RGMII_MDC: K4.59 ; port ETHERNET_PHY.ETH_RGMII_MDC
ETH_RGMII_RX_CLK: K4.30 ; port ETHERNET_PHY.ETH_RGMII_RX_CLK
ETH_RGMII_RXC: K4.34 ; port ETHERNET_PHY.ETH_RGMII_RXC
ETH_RGMII_RXD0: K4.36 ; port ETHERNET_PHY.ETH_RGMII_RXD0
ETH_RGMII_RXD1: K4.38 ; port ETHERNET_PHY.ETH_RGMII_RXD1
ETH_RGMII_RXD2: K4.40 ; port ETHERNET_PHY.ETH_RGMII_RXD2
ETH_RGMII_RXD3: K4.42 ; port ETHERNET_PHY.ETH_RGMII_RXD3
ETH_RGMII_TX_CTL: K4.58 ; port ETHERNET_PHY.ETH_RGMII_TX_CTL
ETH_RGMII_TXD0: K4.50 ; port ETHERNET_PHY.ETH_RGMII_TXD0
ETH_RGMII_TXD1: K4.52 ; port ETHERNET_PHY.ETH_RGMII_TXD1
ETH_RGMII_TXD2: K4.54 ; port ETHERNET_PHY.ETH_RGMII_TXD2
ETH_RGMII_TXD3: K4.56 ; port ETHERNET_PHY.ETH_RGMII_TXD3
GND: K4.1 K4.2 K4.7 K4.8 K4.13 K4.14 K4.19 K4.21 K4.24 K4.27 K4.28 K4.32 K4.37 K4.44 K4.48 K4.51 K4.60 K4.S1(SHIELD) K4.S2(SHIELD) K4.S3(SHIELD) K4.S4(SHIELD) U220.3(GND) U220.8(GND) U221.3(GND) U221.4(GND) U222.3(GND) U222.4(GND)
SPI5_CS: K4.43 ; port SPI_BACKPLANE_GPIO_EX.SPI5_CS
SPI5_MISO: K4.47 ; port SPI_BACKPLANE_GPIO_EX.SPI5_MISO
SPI5_MOSI: K4.45 ; port SPI_BACKPLANE_GPIO_EX.SPI5_MOSI
SPI5_SCK: K4.49 ; port SPI_BACKPLANE_GPIO_EX.SPI5_SCK
/NJRST: K4.26 ; port DEVICE_JTAG.NTRST
BB_GPIO_EXTENDER_IRQ: K4.23 ; port BACKPLANE_GPIO_EX_IRQ
BB_GPIO_EXTENDER_R: K4.25 ; port BACKPLANE_GPIO_EX_RESET
FDCAN2_RX: K4.57 ; port FDCAN2_RX
FDCAN2_TX: K4.55 ; port FDCAN2_TX
PCIE_CLKIN_N: U222.1(D1_P) ; port PCIe - ComboPhy.PCie_CLKIN_N
PCIE_CLKIN_P: U222.2(D1_N) ; port PCIe - ComboPhy.PCIe_CLKIN_P
PCIE_RX_N: U220.9(D1_N_IC) ; port PCIe - ComboPhy.COMBOPHY_RXN
PCIE_RX_P: U220.10(D1_P_IC) ; port PCIe - ComboPhy.COMBOPHY_RXP
PCIE_TX_N: U220.6(D2_N_IC) ; port PCIe - ComboPhy.COMBOPHY_TXN
PCIE_TX_P: U220.7(D2_P_IC) ; port PCIe - ComboPhy.COMBOPHY_TXP
SWCLK: K4.18 ; port DEVICE_JTAG.SWCLK
SWDIO: K4.22 ; port DEVICE_JTAG.SWDIO
TDI: K4.20 ; port DEVICE_JTAG.TDI
TDO: K4.16 ; port DEVICE_JTAG.TDO
USB3.0_BACK_N: K4.6 U221.2(D1_N)
USB3.0_BACK_P: K4.4 U221.1(D1_P)
USB3.0_BB_N: U221.5(D1_N_IC) ; port USB3.0 D-
USB3.0_BB_P: U221.6(D1_P_IC) ; port USB3.0 D+
WIFI_JTAG_SEL: K4.41 ; port WIFI_JTAG.JTAG_SEL
WIFI_NTRST: K4.39 ; port WIFI_JTAG.TRST_L
WIFI_SWCLK: K4.35 ; port WIFI_JTAG.WIFI_JTAG_TCK
WIFI_SWDIO: K4.29 ; port WIFI_JTAG.WIFI_JTAG_TMS
WIFI_TDI: K4.33 ; port WIFI_JTAG.WIFI_JTAG_TDI
WIFI_TDO: K4.31 ; port WIFI_JTAG.WIFI_JTAG_TDO
NetK4_3: K4.3 U220.5(D2_N)
NetK4_5: K4.5 U220.4(D2_P)
NetK4_9: K4.9 U220.2(D1_N)
NetK4_10: K4.10 ; port USBPD_CC2
NetK4_11: K4.11 U220.1(D1_P)
NetK4_12: K4.12 ; port USBPD_CC1
NetK4_15: K4.15 U222.6(D1_P_IC)
NetK4_17: K4.17 U222.5(D1_N_IC)

### Layout directives
differential pair: USB3.0_BACK_N, USB3.0_BACK_P, USB3.0_BB_N, USB3.0_BB_P
net class High Speed Digital: USB3.0_BACK_N, USB3.0_BACK_P

### Notes on the sheet
- swap positions of wifi jtag and PCIe

### Library data of the parts
K4 = DF40C-60DP-0.4V(51): 60 Position Connector Plug, Outer Shroud Contacts Surface Mount Gold; MF: Hirose Electric; Value: *; Purchase-URL: https://pricing.snapeda.com/search/part/DF40C-60DP-0.4V(51)/?ref=eda; MP: DF40C-60DP-0.4V(51); Price: None; Package: None; Availability: In Stock; SnapEDA_Link: https://www.snapeda.com/parts/DF40C-60DP-0.4V(51)/Hirose+Electric+Co+Ltd/view-part/?ref=snap; Check_prices: https://www.snapeda.com/parts/DF40C-60DP-0.4V(51)/Hirose+Electric+Co+Ltd/view-part/?ref=eda
U220 = ECMF4-40A100N10: 4 Line Common Mode Choke Surface Mount 100mA DCR 3Ohm (Typ); ComponentLink1Description: New link; ComponentLink1URL: https://www.digikey.com/en/products/detail/stmicroelectronics/ECMF4-40A100N10/16379603
U221 = ECMF4-40A100N6: 2 Line Common Mode Choke Surface Mount 100mA DCR 3Ohm (Typ)
U222 = ECMF2-40A100N6: 2 Line Common Mode Choke Surface Mount 100mA DCR 3Ohm (Typ); Supplier 1: Arrow Electronics; Supplier Part Number 1: ECMF2-40A100N6

## Nets that join several sheets
1V2_CODEC: Power Management (C203.2 C204.2 U6.13), Audio (C251.2 C252.2 U10.A1)
3V3_IMU: Power Management (C201.2 C202.2 U6.7), IMU Gesture Recognition Sensors (K3.14 K3.16 K3.18 K3.20)
BAT_PACK_IN: Power Management (F2.1), External Power Connectors (D17.2 D20.4 P6.1)
ETH1_MDIO: CPU_Peripherals (U1.AE8), Connector A (K4.53)
ETH_RGMII_GTX_CLK: CPU_Peripherals (U1.AB14), Connector A (K4.46)
ETH_RGMII_MDC: CPU_Peripherals (U1.AF15), Connector A (K4.59)
ETH_RGMII_RX_CLK: CPU_Peripherals (U1.AB12), Connector A (K4.30)
ETH_RGMII_RXC: CPU_Peripherals (U1.AD12), Connector A (K4.34)
ETH_RGMII_RXD0: CPU_Peripherals (U1.AE11), Connector A (K4.36)
ETH_RGMII_RXD1: CPU_Peripherals (U1.AE12), Connector A (K4.38)
ETH_RGMII_RXD2: CPU_Peripherals (U1.AF13), Connector A (K4.40)
ETH_RGMII_RXD3: CPU_Peripherals (U1.AG13), Connector A (K4.42)
ETH_RGMII_TX_CTL: CPU_Peripherals (U1.AD14), Connector A (K4.58)
ETH_RGMII_TXD0: CPU_Peripherals (U1.AE13), Connector A (K4.50)
ETH_RGMII_TXD1: CPU_Peripherals (U1.AG14), Connector A (K4.52)
ETH_RGMII_TXD2: CPU_Peripherals (U1.AF14), Connector A (K4.54)
ETH_RGMII_TXD3: CPU_Peripherals (U1.AE14), Connector A (K4.56)
GND: Translate to rigid Flex gesture recognition (25 pins), CPU_DDR (8 pins), LPDDR4 (112 pins), Power Management (81 pins), CPU_Peripherals (8 pins), eMMC Memory (22 pins), WIFI and BLE (36 pins), Display (13 pins), Connector B (29 pins), CPU_power (128 pins), Audio (25 pins), External Power Connectors (22 pins), IMU Gesture Recognition Sensors (8 pins), Transport Layer Security (C263.1 C264.1 U12.4), Connector A (27 pins)
I2C2_SCL: Power Management (R14.2 R18.1 U3#1.A2), CPU_Peripherals (U1.AA15)
I2C2_SDA: Power Management (R13.2 R17.1 U3#1.A3), CPU_Peripherals (U1.AC15)
I2C5_SCL: CPU_Peripherals (U1.AF19), Transport Layer Security (R142.2 R145.2)
I2C5_SDA: CPU_Peripherals (U1.AC17), Transport Layer Security (R143.2 R146.2)
I2C7_SCL: Power Management (R27.2 R33.1), CPU_Peripherals (U1.AE19)
I2C7_SDA: Power Management (R26.2 R34.1), CPU_Peripherals (U1.AE16)
I2C8_SCL: CPU_Peripherals (U1.V3), Connector B (K5.58 R170.2)
I2C8_SDA: CPU_Peripherals (U1.U3), Connector B (K5.56 R169.2)
MPU_VIN: Translate to rigid Flex gesture recognition (5 pins), Power Management (36 pins)
SAI2_FS_B: CPU_Peripherals (U1.AF18), WIFI and BLE (R75.1 TP23.12)
SAI2_SCK_B: CPU_Peripherals (U1.AF11), WIFI and BLE (R74.1 TP22.12)
SAI2_SD_A_R: CPU_Peripherals (U1.AD4), WIFI and BLE (R76.1 TP24.12)
SAI2_SD_B_T: CPU_Peripherals (U1.AE15), WIFI and BLE (R73.1 TP21.12)
SAI3_FS_B: CPU_Peripherals (U1.AC9), Audio (R113.1)
SAI3_SCK_B: CPU_Peripherals (U1.AG9), Audio (R114.1)
SAI3_SD_A: CPU_Peripherals (U1.AC19), Audio (R168.2)
SAI3_SD_B: CPU_Peripherals (U1.AF9), Audio (R112.1)
SDMMC2_1V8: Power Management (C207.2 C208.2 U6.16), eMMC Memory (R65.1)
SDMMC2_3V3: Power Management (C199.2 C200.2 U6.4), eMMC Memory (10 pins)
SPI1_CS: CPU_Peripherals (U1.D12), IMU Gesture Recognition Sensors (K3.19 R121.1)
SPI1_MISO: CPU_Peripherals (U1.A19), IMU Gesture Recognition Sensors (K3.17)
SPI1_MOSI: CPU_Peripherals (U1.C15), IMU Gesture Recognition Sensors (K3.15)
SPI1_SCK: CPU_Peripherals (U1.A15), IMU Gesture Recognition Sensors (K3.13)
SPI2_CS: CPU_Peripherals (U1.B14), IMU Gesture Recognition Sensors (K3.29 R122.1)
SPI2_MISO: CPU_Peripherals (U1.C13), IMU Gesture Recognition Sensors (K3.27)
SPI2_MOSI: CPU_Peripherals (U1.A14), IMU Gesture Recognition Sensors (K3.25)
SPI2_SCK: CPU_Peripherals (U1.B13), IMU Gesture Recognition Sensors (K3.23)
SPI3_CS: CPU_Peripherals (U1.C12), IMU Gesture Recognition Sensors (K3.39 R123.1)
SPI3_MISO: CPU_Peripherals (U1.B11), IMU Gesture Recognition Sensors (K3.37)
SPI3_MOSI: CPU_Peripherals (U1.D8), IMU Gesture Recognition Sensors (K3.35)
SPI3_SCK: CPU_Peripherals (U1.C11), IMU Gesture Recognition Sensors (K3.33)
SPI4_CS: CPU_Peripherals (U1.B18), IMU Gesture Recognition Sensors (K3.9 R120.1)
SPI4_MISO: CPU_Peripherals (U1.C18), IMU Gesture Recognition Sensors (K3.7)
SPI4_MOSI: CPU_Peripherals (U1.A18), IMU Gesture Recognition Sensors (K3.5)
SPI4_SCK: CPU_Peripherals (U1.D20), IMU Gesture Recognition Sensors (K3.3)
SPI5_CS: CPU_Peripherals (U1.U2), Connector A (K4.43)
SPI5_MISO: CPU_Peripherals (U1.AD6), Connector A (K4.47)
SPI5_MOSI: CPU_Peripherals (U1.AA7), Connector A (K4.45)
SPI5_SCK: CPU_Peripherals (U1.T3), Connector A (K4.49)
SPI7_CS: CPU_Peripherals (U1.M6), IMU Gesture Recognition Sensors (K3.32 R125.1)
SPI7_MISO: CPU_Peripherals (U1.N3), IMU Gesture Recognition Sensors (K3.34)
SPI7_MOSI: CPU_Peripherals (U1.N2), IMU Gesture Recognition Sensors (K3.36)
SPI7_SCK: CPU_Peripherals (U1.P1), IMU Gesture Recognition Sensors (K3.38)
SYS_1V8: Translate to rigid Flex gesture recognition (B?#1.A2 B?#2.A2 B?#3.A2 B?#4.A2), Power Management (10 pins), WIFI and BLE (C230.2 C231.2 DNC.2 Y3.4), Display (K6.18 K6.20), Connector B (K5.41 K5.43), CPU_power (25 pins), Audio (6 pins)
SYS_3V3: Translate to rigid Flex gesture recognition (14 pins), CPU_DDR (R3.1), Power Management (15 pins), CPU_Peripherals (5 pins), WIFI and BLE (C227.2 C228.2 R89.2 U8.3), Display (6 pins), Connector B (6 pins), CPU_power (29 pins), Audio (8 pins), External Power Connectors (R151.1 R164.1), IMU Gesture Recognition Sensors (5 pins), Transport Layer Security (6 pins)
UART8_CTS: CPU_Peripherals (U1.AG18), WIFI and BLE (R78.1 TP26.12)
UART8_RTS: CPU_Peripherals (U1.AE6), WIFI and BLE (R80.1 TP28.12)
UART8_RX: CPU_Peripherals (U1.AE4), WIFI and BLE (R77.1 TP25.12)
UART8_TX: CPU_Peripherals (U1.AE5), WIFI and BLE (R79.1 TP27.12)
USART2_RX: CPU_Peripherals (U1.AA17), Connector B (K5.20)
USART2_TX: CPU_Peripherals (U1.AG17), Connector B (K5.22)
USART6_RX: CPU_Peripherals (U1.AA11), Connector B (K5.14)
USART6_TX: CPU_Peripherals (U1.AF10), Connector B (K5.16)
USB_VIN: Power Management (F1.2), Connector B (6 pins), External Power Connectors (7 pins)
VBACKUP: CPU_power (C18.2 U1.T6), External Power Connectors (P1.1)
VDD_EMMC: eMMC Memory (21 pins), CPU_power (C83.2 C85.2 U1.D18 U1.E17)
VDD_SOC_0V8: Power Management (10 pins), CPU_power (64 pins)
VDDQDDR_1V1: CPU_DDR (R6.2), LPDDR4 (94 pins), Power Management (5 pins), CPU_power (19 pins)
VPP_DDR_1V8: LPDDR4 (17 pins), Power Management (C205.2 C206.2 U6.44)
/NJRST: CPU_DDR (U1.AF3), Connector A (K4.26)
/NRST: CPU_DDR (U1.AE1), Power Management (R29.2 R31.1), Connector B (R131.1)
/NRSTC1MS: CPU_DDR (U1.W3), Power Management (R35.1 R38.1)
/PD_CODEC: CPU_Peripherals (U1.AE9), Audio (R116.2)
BB_GPIO_EXTENDER_IRQ: CPU_Peripherals (U1.C14), Connector A (K4.23)
BB_GPIO_EXTENDER_R: CPU_Peripherals (U1.E15), Connector A (K4.25)
BKUP_IRQ_CODEC: CPU_Peripherals (U1.AD10), Audio (R109.1)
BOOT0: CPU_DDR (U1.Y3), Connector B (K5.10)
BOOT1: CPU_DDR (U1.AA3), Connector B (K5.8)
BOOT2: CPU_DDR (U1.AB1), Connector B (K5.4)
BOOT3: CPU_DDR (U1.AB2), Connector B (K5.6)
BT_GPIO_3: CPU_Peripherals (U1.N1), WIFI and BLE (R82.1)
CSI_CK_N: CPU_DDR (U1.D4), Connector B (K5.17)
CSI_CK_P: CPU_DDR (U1.C4), Connector B (K5.15)
CSI_D0_N: CPU_DDR (U1.A3), Connector B (K5.11)
CSI_D0_P: CPU_DDR (U1.B3), Connector B (K5.9)
DDR_CA0_A: CPU_DDR (U1.V24), LPDDR4 (U2.H2)
DDR_CA0_B: CPU_DDR (U1.M24), LPDDR4 (U2.R2)
DDR_CA1_A: CPU_DDR (U1.P22), LPDDR4 (U2.J2)
DDR_CA1_B: CPU_DDR (U1.N23), LPDDR4 (U2.P2)
DDR_CA2_A: CPU_DDR (U1.V22), LPDDR4 (U2.H9)
DDR_CA2_B: CPU_DDR (U1.J21), LPDDR4 (U2.R9)
DDR_CA3_A: CPU_DDR (U1.T22), LPDDR4 (U2.H10)
DDR_CA3_B: CPU_DDR (U1.H22), LPDDR4 (U2.R10)
DDR_CA4_A: CPU_DDR (U1.R23), LPDDR4 (U2.H11)
DDR_CA4_B: CPU_DDR (U1.F22), LPDDR4 (U2.R11)
DDR_CA5_A: CPU_DDR (U1.P24), LPDDR4 (U2.J11)
DDR_CA5_B: CPU_DDR (U1.E23), LPDDR4 (U2.P11)
DDR_CK_A_N: CPU_DDR (U1.U23), LPDDR4 (U2.J8)
DDR_CK_A_P: CPU_DDR (U1.T24), LPDDR4 (U2.J9)
DDR_CK_B_N: CPU_DDR (U1.J23), LPDDR4 (U2.P8)
DDR_CK_B_P: CPU_DDR (U1.H24), LPDDR4 (U2.P9)
DDR_CKE0_A: CPU_DDR (U1.U21), LPDDR4 (U2.J4)
DDR_CKE0_B: CPU_DDR (U1.L23), LPDDR4 (U2.P4)
DDR_CKE1_A: CPU_DDR (U1.AD25), LPDDR4 (U2.J5)
DDR_CKE1_B: CPU_DDR (U1.K24), LPDDR4 (U2.P5)
DDR_CS0_A: CPU_DDR (U1.Y24), LPDDR4 (U2.H4)
DDR_CS0_B: CPU_DDR (U1.G23), LPDDR4 (U2.R4)
DDR_CS1_A: CPU_DDR (U1.AC25), LPDDR4 (U2.H3)
DDR_CS1_B: CPU_DDR (U1.L21), LPDDR4 (U2.R3)
DDR_DQ0_A: CPU_DDR (U1.AB26), LPDDR4 (U2.B2)
DDR_DQ0_B: CPU_DDR (U1.F25), LPDDR4 (U2.AA2)
DDR_DQ1_A: CPU_DDR (U1.AC26), LPDDR4 (U2.C2)
DDR_DQ1_B: CPU_DDR (U1.E26), LPDDR4 (U2.Y2)
DDR_DQ2_A: CPU_DDR (U1.AB27), LPDDR4 (U2.E2)
DDR_DQ2_B: CPU_DDR (U1.F24), LPDDR4 (U2.V2)
DDR_DQ3_A: CPU_DDR (U1.AC27), LPDDR4 (U2.F2)
DDR_DQ3_B: CPU_DDR (U1.E25), LPDDR4 (U2.U2)
DDR_DQ4_A: CPU_DDR (U1.W25), LPDDR4 (U2.F4)
DDR_DQ4_B: CPU_DDR (U1.J25), LPDDR4 (U2.U4)
DDR_DQ5_A: CPU_DDR (U1.W27), LPDDR4 (U2.E4)
DDR_DQ5_B: CPU_DDR (U1.H25), LPDDR4 (U2.V4)
DDR_DQ6_A: CPU_DDR (U1.W26), LPDDR4 (U2.C4)
DDR_DQ6_B: CPU_DDR (U1.G26), LPDDR4 (U2.Y4)
DDR_DQ7_A: CPU_DDR (U1.Y25), LPDDR4 (U2.B4)
DDR_DQ7_B: CPU_DDR (U1.G25), LPDDR4 (U2.AA4)
DDR_DQ8_A: CPU_DDR (U1.R27), LPDDR4 (U2.B11)
DDR_DQ8_B: CPU_DDR (U1.J26), LPDDR4 (U2.AA11)
DDR_DQ9_A: CPU_DDR (U1.R26), LPDDR4 (U2.C11)
DDR_DQ9_B: CPU_DDR (U1.K25), LPDDR4 (U2.Y11)
DDR_DQ10_A: CPU_DDR (U1.P27), LPDDR4 (U2.E11)
DDR_DQ10_B: CPU_DDR (U1.K26), LPDDR4 (U2.V11)
DDR_DQ11_A: CPU_DDR (U1.P26), LPDDR4 (U2.F11)
DDR_DQ11_B: CPU_DDR (U1.K27), LPDDR4 (U2.U11)
DDR_DQ12_A: CPU_DDR (U1.V26), LPDDR4 (U2.F9)
DDR_DQ12_B: CPU_DDR (U1.L25), LPDDR4 (U2.U9)
DDR_DQ13_A: CPU_DDR (U1.V27), LPDDR4 (U2.E9)
DDR_DQ13_B: CPU_DDR (U1.N25), LPDDR4 (U2.V9)
DDR_DQ14_A: CPU_DDR (U1.V25), LPDDR4 (U2.C9)
DDR_DQ14_B: CPU_DDR (U1.N26), LPDDR4 (U2.Y9)
DDR_DQ15_A: CPU_DDR (U1.U25), LPDDR4 (U2.B9)
DDR_DQ15_B: CPU_DDR (U1.P25), LPDDR4 (U2.AA9)
DDR_DQM0_A: CPU_DDR (U1.AB25), LPDDR4 (U2.C3)
DDR_DQM0_B: CPU_DDR (U1.G27), LPDDR4 (U2.Y3)
DDR_DQM1_A: CPU_DDR (U1.U26), LPDDR4 (U2.C10)
DDR_DQM1_B: CPU_DDR (U1.M25), LPDDR4 (U2.Y10)
DDR_RESET: CPU_DDR (U1.E21), LPDDR4 (R8.2 U2.T11)
DISPLAY_RESET: CPU_Peripherals (U1.P4), Display (K6.1 R139.1)
DSI_CLK_N: CPU_DDR (U1.C8), Display (C261.2)
DSI_CLK_P: CPU_DDR (U1.C7), Display (C262.2)
DSI_DATA_D0_N: CPU_DDR (U1.C9), Display (C260.2)
DSI_DATA_D0_P: CPU_DDR (U1.B9), Display (C259.2)
DSQ0_A_N: CPU_DDR (U1.AA26), LPDDR4 (U2.E3)
DSQ0_A_P: CPU_DDR (U1.AA25), LPDDR4 (U2.D3)
DSQ0_B_N: CPU_DDR (U1.F26), LPDDR4 (U2.V3)
DSQ0_B_P: CPU_DDR (U1.F27), LPDDR4 (U2.W3)
DSQ1_A_N: CPU_DDR (U1.R25), LPDDR4 (U2.E10)
DSQ1_A_P: CPU_DDR (U1.T25), LPDDR4 (U2.D10)
DSQ1_B_N: CPU_DDR (U1.L27), LPDDR4 (U2.V10)
DSQ1_B_P: CPU_DDR (U1.L26), LPDDR4 (U2.W10)
eMMC_CLK_MPU: CPU_Peripherals (U1.B25), eMMC Memory (R63.1 TP17.12)
eMMC_CMD_MPU: CPU_Peripherals (U1.D24), eMMC Memory (R62.1 TP16.12)
eMMC_DAT0_MPU: CPU_Peripherals (U1.C24), eMMC Memory (R53.1 TP7.12)
eMMC_DAT1_MPU: CPU_Peripherals (U1.B23), eMMC Memory (R54.1 TP8.12)
eMMC_DAT2_MPU: CPU_Peripherals (U1.C23), eMMC Memory (R55.1 TP9.12)
eMMC_DAT3_MPU: CPU_Peripherals (U1.C25), eMMC Memory (R56.1 TP10.12)
eMMC_DAT4_MPU: CPU_Peripherals (U1.D22), eMMC Memory (R57.1 TP11.12)
eMMC_DAT5_MPU: CPU_Peripherals (U1.A23), eMMC Memory (R58.1 TP12.12)
eMMC_DAT6_MPU: CPU_Peripherals (U1.A22), eMMC Memory (R59.1 TP13.12)
eMMC_DAT7_MPU: CPU_Peripherals (U1.B22), eMMC Memory (R60.1 TP14.12)
eMMC_DS_MPU: CPU_Peripherals (U1.AE10), eMMC Memory (R61.1 TP15.12)
eMMC_RST_MPU: CPU_Peripherals (U1.AB8), eMMC Memory (R64.1 TP18.12)
EXT_ADC_IRQ: CPU_Peripherals (U1.C16), IMU Gesture Recognition Sensors (K3.28)
FDCAN2_RX: CPU_Peripherals (U1.D16), Connector A (K4.57)
FDCAN2_TX: CPU_Peripherals (U1.U1), Connector A (K4.55)
GPIO_EXTENDER_IRQ: CPU_Peripherals (U1.B17), IMU Gesture Recognition Sensors (K3.24)
GPIO_EXTENDER_RESET: CPU_Peripherals (U1.C17), IMU Gesture Recognition Sensors (K3.26)
INTn_PMIC: Power Management (R28.2 R32.1), CPU_Peripherals (U1.AF17)
LVDS1_CLK_N: CPU_DDR (U1.K2), Connector B (U301.6)
LVDS1_CLK_P: CPU_DDR (U1.K1), Connector B (U301.7)
LVDS1_D0_N: CPU_DDR (U1.G3), Connector B (U300.7)
LVDS1_D0_P: CPU_DDR (U1.G2), Connector B (U300.6)
LVDS1_D1_N: CPU_DDR (U1.H4), Connector B (U300.10)
LVDS1_D1_P: CPU_DDR (U1.H3), Connector B (U300.9)
LVDS1_D2_N: CPU_DDR (U1.J2), Connector B (U301.10)
LVDS1_D2_P: CPU_DDR (U1.J1), Connector B (U301.9)
LVDS1_D3_N: CPU_DDR (U1.L3), Connector B (U302.5)
LVDS1_D3_P: CPU_DDR (U1.L2), Connector B (U302.6)
MAIN_IRQ_CODEC: CPU_Peripherals (U1.AB10), Audio (R115.2)
NetK4_10: CPU_Peripherals (U1.AA19), Connector A (K4.10)
NetK4_12: CPU_Peripherals (U1.AB18), Connector A (K4.12)
NetK6_2: CPU_Peripherals (U1.K4), Display (K6.2)
NetK6_5: CPU_Peripherals (U1.J3), Display (K6.5)
NetR36_1: CPU_DDR (U1.AB4), Power Management (R36.1 R39.1)
NetR37_1: CPU_DDR (U1.AD3), Power Management (R37.1 R40.1)
NetR66_2: CPU_Peripherals (U1.AF7), WIFI and BLE (R66.2 TP40.12 U8.4)
NetR67_2: CPU_Peripherals (U1.AG5), WIFI and BLE (R67.2 U8.68)
NetR83_1: CPU_Peripherals (U1.L5), WIFI and BLE (R83.1)
NetR90_1: CPU_Peripherals (U1.P3), WIFI and BLE (R90.1 U8.52)
NetU1_L7: CPU_Peripherals (U1.L7), WIFI and BLE (U8.45)
NetU1_P2: CPU_Peripherals (U1.P2), WIFI and BLE (U8.17)
NetU1_R2: CPU_Peripherals (U1.R2), WIFI and BLE (U8.51)
PA_GAIN: CPU_Peripherals (U1.AE7), Audio (R105.1)
PA_SHDN: CPU_Peripherals (U1.AG10), Audio (R103.1)
PA_SHDN_MODE: CPU_Peripherals (U1.AD8), Audio (R104.1)
PCIE_CLKIN_N: CPU_DDR (U1.AE26), Connector A (U222.1)
PCIE_CLKIN_P: CPU_DDR (U1.AE25), Connector A (U222.2)
PCIE_RX_N: CPU_DDR (U1.AF25), Connector A (U220.9)
PCIE_RX_P: CPU_DDR (U1.AG25), Connector A (U220.10)
PCIE_TX_N: CPU_DDR (C8.2), Connector A (U220.6)
PCIE_TX_P: CPU_DDR (C7.2), Connector A (U220.7)
SD_CARD_CD: CPU_Peripherals (U1.N5), Connector B (K5.35)
SD_CARD_WP: CPU_Peripherals (U1.N7), Connector B (K5.37)
SDMMC_CLK: CPU_Peripherals (U1.C21), Connector B (K5.21)
SDMMC_CMD: CPU_Peripherals (U1.C20), Connector B (K5.23)
SDMMC_DAT0: CPU_Peripherals (U1.B21), Connector B (K5.31)
SDMMC_DAT1: CPU_Peripherals (U1.C22), Connector B (K5.29)
SDMMC_DAT2: CPU_Peripherals (U1.B19), Connector B (K5.27)
SDMMC_DAT3: CPU_Peripherals (U1.C19), Connector B (K5.25)
SPI8_CSS: CPU_Peripherals (U1.Y6), Display (R137.1 R138.2)
SPI8_DCX: CPU_Peripherals (U1.R5), Display (R136.1 R140.1)
SPI8_MISO: CPU_Peripherals (U1.U7), Display (R134.1)
SPI8_MOSI: CPU_Peripherals (U1.T4), Display (R133.1)
SPI8_SCK: CPU_Peripherals (U1.W5), Display (R135.1)
STATUS_EXT_BAT_MPU: CPU_Peripherals (U1.AD18), External Power Connectors (Q4.2 R151.2)
STATUS_EXT_USB_MPU: CPU_Peripherals (U1.AE18), External Power Connectors (Q3.2 R164.2)
STSAFE_RESET: CPU_Peripherals (U1.AA13), Transport Layer Security (R141.2 R144.2)
SWCLK: CPU_DDR (U1.AA5), Connector A (K4.18)
SWDIO: CPU_DDR (U1.AE2), Connector A (K4.22)
TDI: CPU_DDR (U1.AE3), Connector A (K4.20)
TDO: CPU_DDR (U1.AC2), Connector A (K4.16)
TIM20_PWM: CPU_Peripherals (U1.B15), Connector B (K5.24)
UART5_RX: CPU_Peripherals (U1.M4), Audio (R111.1)
UART5_TX: CPU_Peripherals (U1.M3), Audio (R110.1)
USB3.0_BB_N: CPU_Peripherals (R171.1), Connector A (U221.5)
USB3.0_BB_P: CPU_Peripherals (R172.1), Connector A (U221.6)
USB_N: CPU_Peripherals (R171.2 U13.7), External Power Connectors (D21.2 K7.A7 K7.B7)
USB_P: CPU_Peripherals (R172.2 U13.8), External Power Connectors (D21.1 K7.A6 K7.B6)
WAKEUPn_PMIC: Power Management (R30.1), CPU_Peripherals (U1.AF5)
WIFI_JTAG_SEL: WIFI and BLE (U8.53), Connector A (K4.41)
WIFI_NTRST: WIFI and BLE (U8.63), Connector A (K4.39)
WIFI_SDMMC3_CK: CPU_Peripherals (U1.A26), WIFI and BLE (R88.1)
WIFI_SDMMC3_CMD: CPU_Peripherals (U1.B26), WIFI and BLE (R72.1 R84.1)
WIFI_SDMMC3_DAT0: CPU_Peripherals (U1.C27), WIFI and BLE (R70.1 R85.1)
WIFI_SDMMC3_DAT1: CPU_Peripherals (U1.D25), WIFI and BLE (R71.1 R185.1)
WIFI_SDMMC3_DAT2: CPU_Peripherals (U1.C26), WIFI and BLE (R68.1 R87.1)
WIFI_SDMMC3_DAT3: CPU_Peripherals (U1.E19), WIFI and BLE (R69.1 R86.1)
WIFI_SWCLK: WIFI and BLE (U8.66), Connector A (K4.35)
WIFI_SWDIO: WIFI and BLE (U8.67), Connector A (K4.29)
WIFI_TDI: WIFI and BLE (U8.64), Connector A (K4.33)
WIFI_TDO: WIFI and BLE (U8.65), Connector A (K4.31)
WIFI_USB_N: CPU_Peripherals (U13.6), WIFI and BLE (U8.46)
WIFI_USB_P: CPU_Peripherals (U13.5), WIFI and BLE (U8.47)